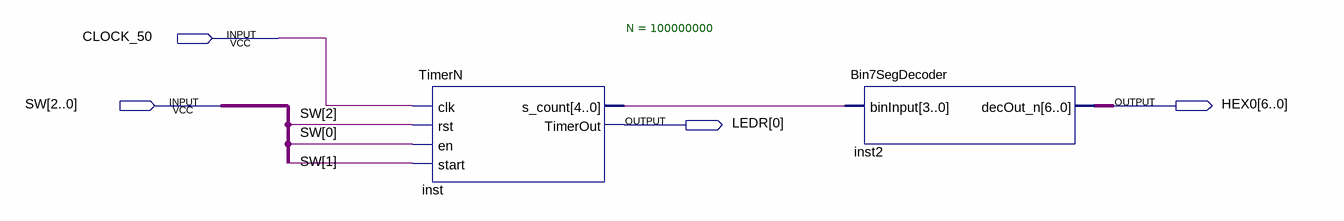
[diagram p0: schematic sheet]
// Quartus schematic TimerN_Demo.bdf as structural Verilog: 2 symbols, 4 pins
module TimerN_Demo (
  input  CLOCK_50,
  input  [2:0] SW,
  output [6:0] HEX0,
  output [0:0] LEDR
);

  wire inst_s_count;

  TimerN #(.N(100000000)) inst (
    .clk(CLOCK_50), .rst(SW[2]), .en(SW[0]), .start(SW[1]), .s_count(inst_s_count), .TimerOut(LEDR[0]));
  Bin7SegDecoder inst2 (.binInput({4{inst_s_count}}), .decOut_n(HEX0));
endmodule
